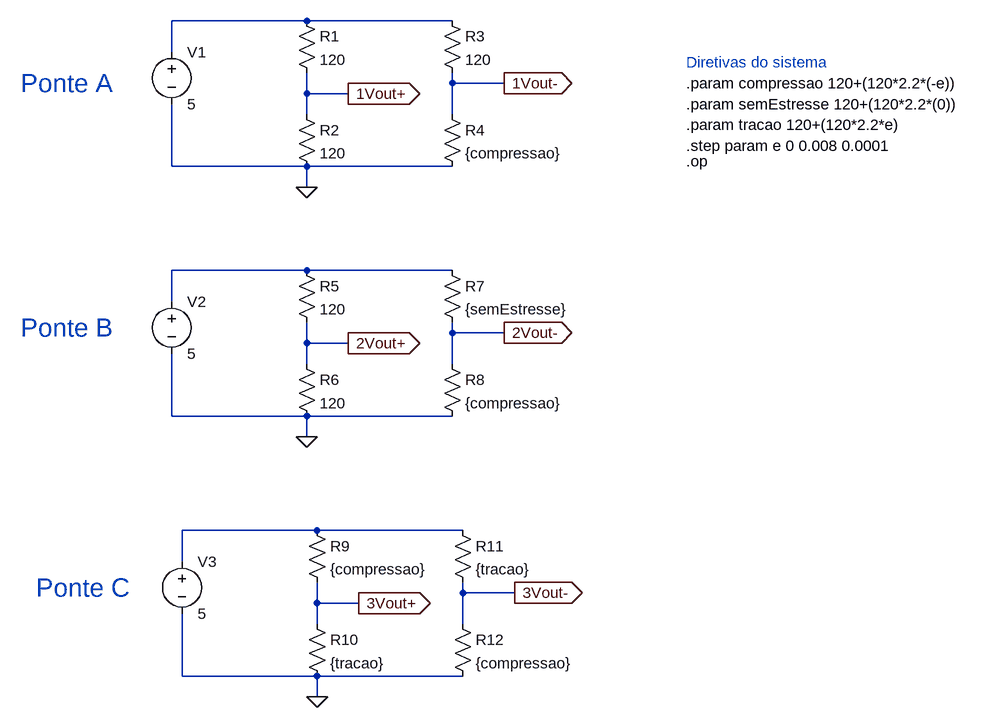
[diagram p0: schematic questaoA_P2.asc]
questaoA_P2.asc, the LTspice schematic file:
Version 4
SHEET 1 1024 976
WIRE -32 -128 -240 -128
WIRE 192 -128 -32 -128
WIRE -240 -80 -240 -128
WIRE 192 -32 192 -48
WIRE 272 -32 192 -32
WIRE -32 -16 -32 -48
WIRE 32 -16 -32 -16
WIRE -32 16 -32 -16
WIRE 192 16 192 -32
WIRE -240 96 -240 0
WIRE -32 96 -240 96
WIRE 192 96 -32 96
WIRE -32 128 -32 96
WIRE -32 256 -240 256
WIRE 192 256 -32 256
WIRE -240 304 -240 256
WIRE 192 352 192 336
WIRE 272 352 192 352
WIRE -32 368 -32 336
WIRE 32 368 -32 368
WIRE -32 400 -32 368
WIRE 192 400 192 352
WIRE -240 480 -240 384
WIRE -32 480 -240 480
WIRE 192 480 -32 480
WIRE -32 512 -32 480
WIRE -16 656 -224 656
WIRE 208 656 -16 656
WIRE -224 704 -224 656
WIRE 208 752 208 736
WIRE 288 752 208 752
WIRE -16 768 -16 736
WIRE 48 768 -16 768
WIRE -16 800 -16 768
WIRE 208 800 208 752
WIRE -224 880 -224 784
WIRE -16 880 -224 880
WIRE 208 880 -16 880
WIRE -16 912 -16 880
FLAG 32 -16 1Vout+
IOPIN 32 -16 Out
FLAG 32 368 2Vout+
IOPIN 32 368 Out
FLAG 48 768 3Vout+
IOPIN 48 768 Out
FLAG 272 -32 1Vout-
IOPIN 272 -32 Out
FLAG 272 352 2Vout-
IOPIN 272 352 Out
FLAG 288 752 3Vout-
IOPIN 288 752 Out
FLAG -32 128 0
FLAG -32 512 0
FLAG -16 912 0
SYMBOL voltage -240 -96 R0
WINDOW 123 0 0 Left 0
WINDOW 39 0 0 Left 0
SYMATTR InstName V1
SYMATTR Value 5
SYMBOL res -48 -144 R0
SYMATTR InstName R1
SYMATTR Value 120
SYMBOL res -48 0 R0
SYMATTR InstName R2
SYMATTR Value 120
SYMBOL res 176 -144 R0
SYMATTR InstName R3
SYMATTR Value 120
SYMBOL res 176 0 R0
SYMATTR InstName R4
SYMATTR Value {compressao}
SYMBOL voltage -240 288 R0
WINDOW 123 0 0 Left 0
WINDOW 39 0 0 Left 0
SYMATTR InstName V2
SYMATTR Value 5
SYMBOL res -48 240 R0
SYMATTR InstName R5
SYMATTR Value 120
SYMBOL res -48 384 R0
SYMATTR InstName R6
SYMATTR Value 120
SYMBOL res 176 240 R0
SYMATTR InstName R7
SYMATTR Value {semEstresse}
SYMBOL res 176 384 R0
SYMATTR InstName R8
SYMATTR Value {compressao}
SYMBOL voltage -224 688 R0
WINDOW 123 0 0 Left 0
WINDOW 39 0 0 Left 0
SYMATTR InstName V3
SYMATTR Value 5
SYMBOL res -32 640 R0
SYMATTR InstName R9
SYMATTR Value {compressao}
SYMBOL res -32 784 R0
SYMATTR InstName R10
SYMATTR Value {tracao}
SYMBOL res 192 640 R0
SYMATTR InstName R11
SYMATTR Value {tracao}
SYMBOL res 192 784 R0
SYMATTR InstName R12
SYMATTR Value {compressao}
TEXT 552 64 Left 2 !.step param e 0 0.008 0.0001
TEXT 552 88 Left 2 !.op
TEXT 552 -32 Left 2 !.param compressao 120+(120*2.2*(-e))
TEXT 552 0 Left 2 !.param semEstresse 120+(120*2.2*(0))
TEXT 552 32 Left 2 !.param tracao 120+(120*2.2*e)
TEXT -472 -32 Left 4 ;Ponte A
TEXT -472 344 Left 4 ;Ponte B
TEXT -448 744 Left 4 ;Ponte C
TEXT 552 -64 Left 2 ;Diretivas do sistema

The netlist it stands for:
* questaoA_P2.asc
V1 N001 0 5
R1 N001 1Vout+ 120
R2 1Vout+ 0 120
R3 N001 1Vout- 120
R4 1Vout- 0 {compressao}
V2 N002 0 5
R5 N002 2Vout+ 120
R6 2Vout+ 0 120
R7 N002 2Vout- {semEstresse}
R8 2Vout- 0 {compressao}
V3 N003 0 5
R9 N003 3Vout+ {compressao}
R10 3Vout+ 0 {tracao}
R11 N003 3Vout- {tracao}
R12 3Vout- 0 {compressao}
.step param e 0 0.008 0.0001
.op
.param compressao 120+(120*2.2*(-e))
.param semEstresse 120+(120*2.2*(0))
.param tracao 120+(120*2.2*e)
* Ponte A
* Ponte B
* Ponte C
* Diretivas do sistema
.backanno
.end

* Results of the author's LTspice run, read from the files saved beside the schematic
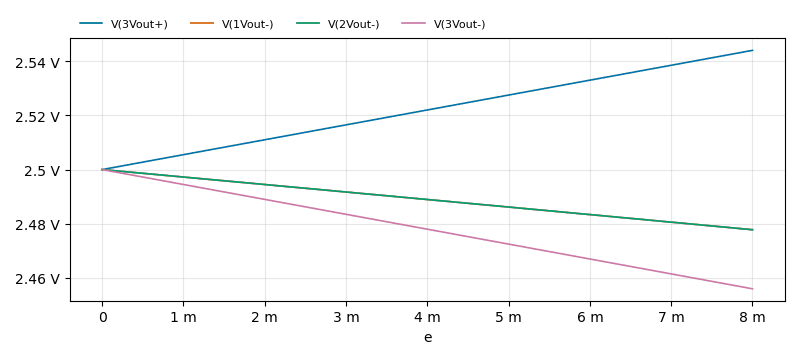
[diagram p1: Operating Point of questaoA_P2.asc, plotted from the saved traces]
* Operating Point, 1 run:
*   V(3Vout+): 2.5 V at e=0, 2.544 V at e=8 m, min 2.5 V, max 2.544 V
*   V(1Vout-): 2.5 V at e=0, 2.478 V at e=8 m, min 2.478 V, max 2.5 V
*   V(2Vout-): 2.5 V at e=0, 2.478 V at e=8 m, min 2.478 V, max 2.5 V
*   V(3Vout-): 2.5 V at e=0, 2.456 V at e=8 m, min 2.456 V, max 2.5 V